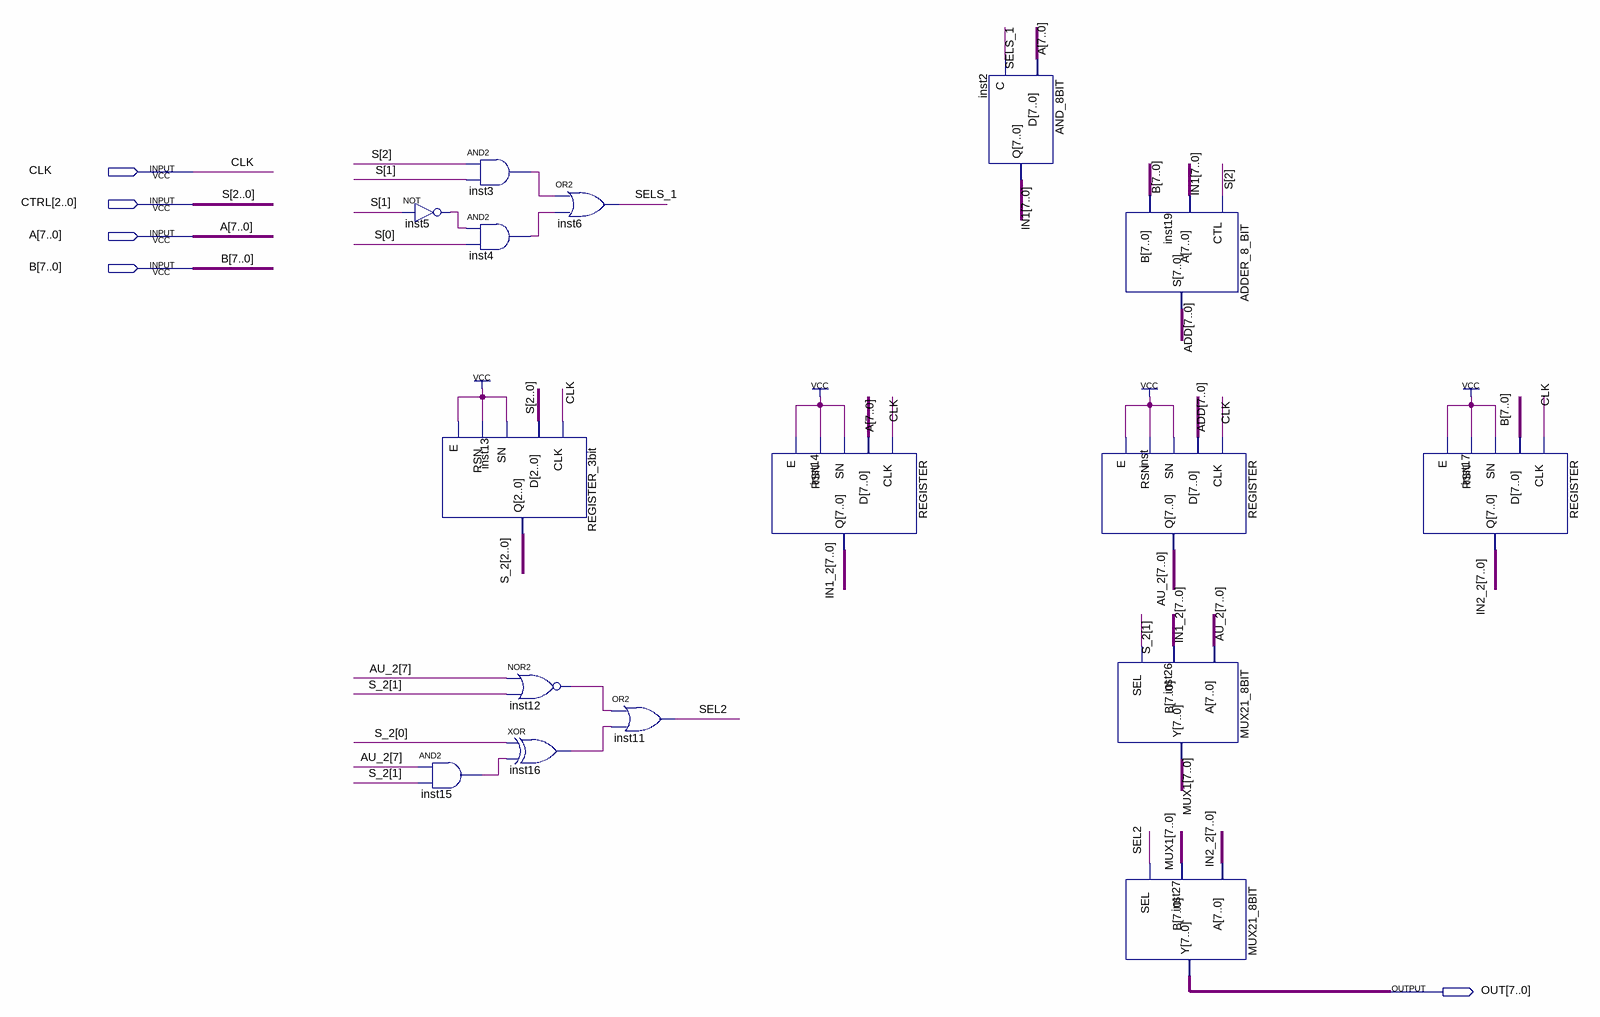
[diagram p0: schematic sheet]
// Quartus schematic AU_piplined.bdf as structural Verilog: 16 symbols, 5 pins
module AU_piplined (
  input  CLK,
  input  [2:0] CTRL,
  input  [7:0] A,
  input  [7:0] B,
  output [7:0] OUT
);

  wire inst3_out, inst4_out, inst5_out, inst12_out, inst15_out, inst16_out, SEL2, SELS_1;
  wire [2:0] S_2;
  wire [7:0] ADD, AU_2, IN1, IN1_2, IN2_2, MUX1;

  not inst5 (inst5_out, CTRL[1]);
  and inst15 (inst15_out, AU_2[7], S_2[1]);
  and inst3 (inst3_out, CTRL[2], CTRL[1]);
  and inst4 (inst4_out, inst5_out, CTRL[0]);
  REGISTER_3bit inst13 (.CLK(CLK), .D(CTRL), .SN(1'b1), .RSN(1'b1), .E(1'b1), .Q(S_2));
  or inst6 (SELS_1, inst3_out, inst4_out);
  nor inst12 (inst12_out, AU_2[7], S_2[1]);
  xor inst16 (inst16_out, S_2[0], inst15_out);
  or inst11 (SEL2, inst12_out, inst16_out);
  REGISTER inst14 (.CLK(CLK), .D(A), .SN(1'b1), .RSN(1'b1), .E(1'b1), .Q(IN1_2));
  AND_8BIT inst2 (.D(A), .C(SELS_1), .Q(IN1));
  ADDER_8_BIT inst19 (.CTL(CTRL[2]), .A(IN1), .B(B), .S(ADD));
  REGISTER inst (.CLK(CLK), .D(ADD), .SN(1'b1), .RSN(1'b1), .E(1'b1), .Q(AU_2));
  MUX21_8BIT inst26 (.A(AU_2), .B(IN1_2), .SEL(S_2[1]), .Y(MUX1));
  MUX21_8BIT inst27 (.A(IN2_2), .B(MUX1), .SEL(SEL2), .Y(OUT));
  REGISTER inst17 (.CLK(CLK), .D(B), .SN(1'b1), .RSN(1'b1), .E(1'b1), .Q(IN2_2));

  // Other names for the same wires on the sheet: S[2:0] = CTRL
endmodule
